# EasyEDA schematic SCH_PC-Engine-Controller-Breakout_2024-10-27.json
TITLE: MegaExpress Controller Breakout; REV: 1.0; Date: 2024-10-05; Sheet: 1/1; Drawn By: jonn.blanchard; Company: RE:Enthused
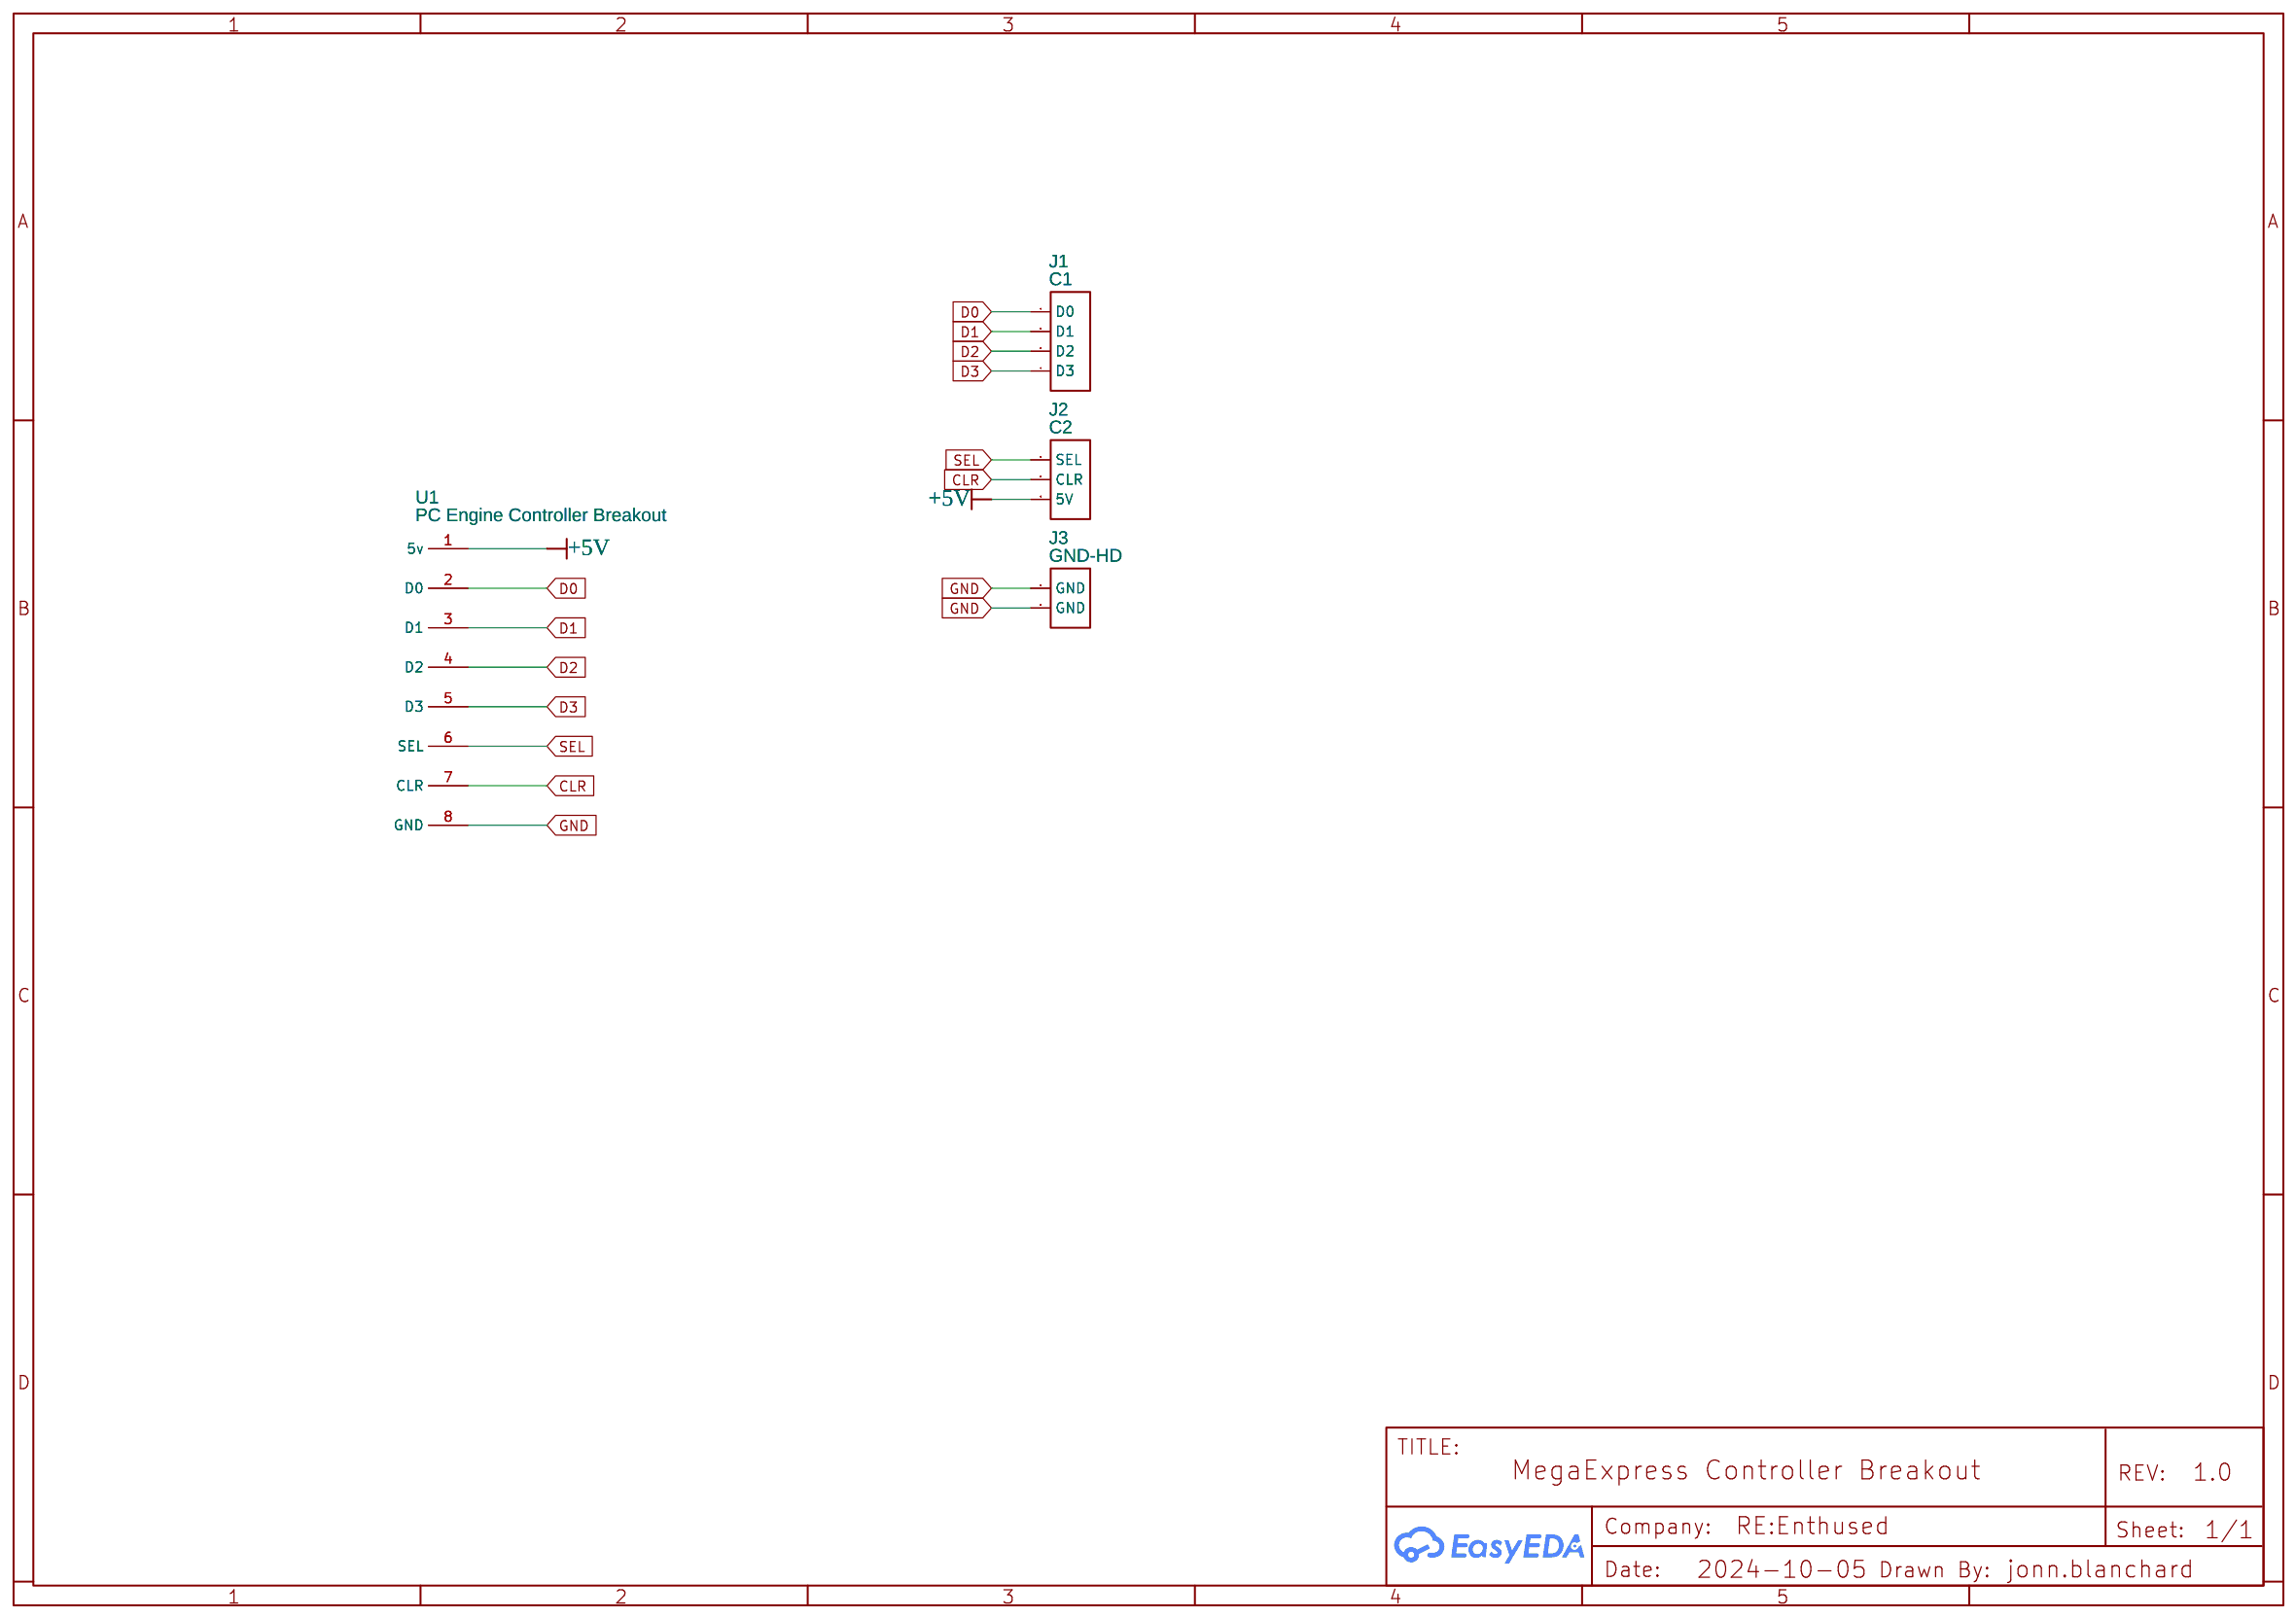
[diagram p0: schematic sheet]

## Parts
J1  C1  [HDR-M-2.54_1X4]
J2  C2  [HDR-M-2.54_1X3]
J3  GND-HD  [HDR-M-2.54_1X2]
U1  PC Engine Controller Breakout  [PC ENGINE CONTROLLER BREAKOUT]

## Library data of the parts
J1 = HDR-M-2.54_1x4: Supplier Part: C124378; Supplier: LCSC; Contributor: LCEDA_Lib
J2 = HDR-M-2.54_1x3: Supplier Part: C180248; Supplier: LCSC; Contributor: LCEDA_Lib
J3 = HDR-M-2.54_1x2: Supplier Part: C124375; Supplier: LCSC; Contributor: LCEDA_Lib
U1 = PC Engine Controller Breakout: Contributor: jonn.blanchard

## Nets
+5V: J2.3(5V) U1.1(5v)
GND: J3.1(GND) J3.2(GND) U1.8(GND)
CLR: J2.2(CLR) U1.7(CLR)
D0: J1.1(D0) U1.2(D0)
D1: J1.2(D1) U1.3(D1)
D2: J1.3(D2) U1.4(D2)
D3: J1.4(D3) U1.5(D3)
SEL: J2.1(SEL) U1.6(SEL)
